# EAGLE design dimmerPower2 (EAGLE 9.2.0)
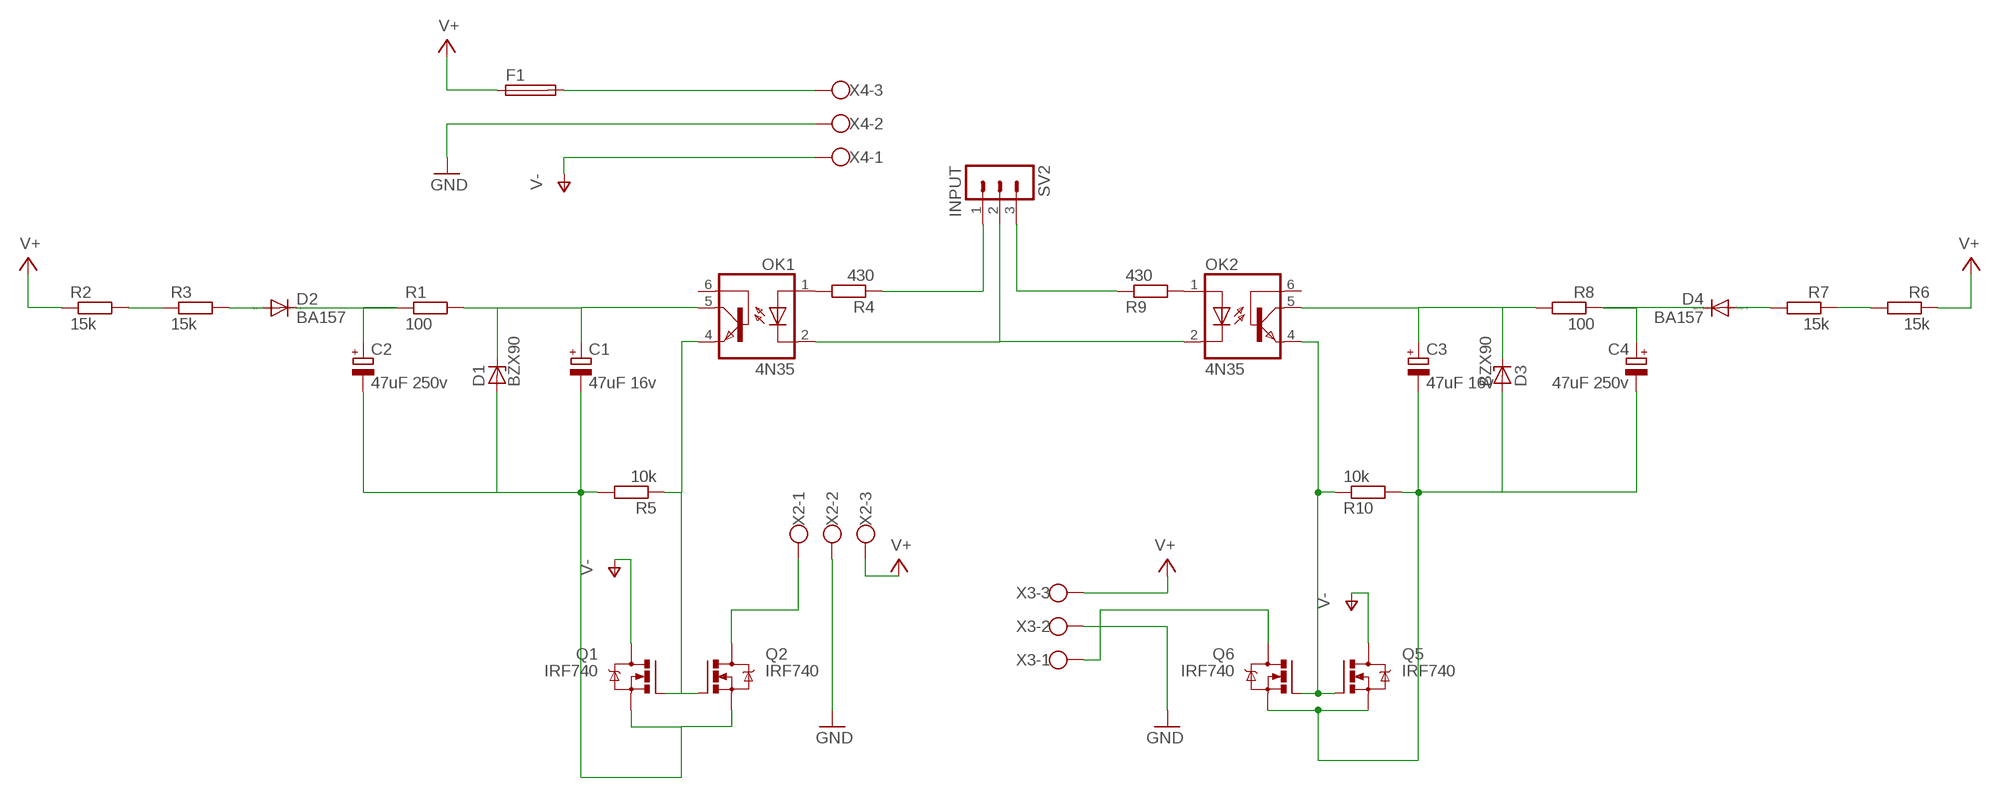
[diagram p0: schematic, sheet 1]

## Parts
C1  47uF 16v  CPOL-EUE2.5-6  [E2,5-6]
C2  47uF 250v  CPOL-EUE5-13  [E5-13]
C3  47uF 16v  CPOL-EUE2.5-6  [E2,5-6]
C4  47uF 250v  CPOL-EUE5-13  [E5-13]
D1  BZX90  [DO34Z7]
D2  BA157  [P1-10]
D3  BZX90  [DO34Z7]
D4  BA157  [P1-10]
F1  SH22,5  [SH22,5]
OK1  4N35  [DIL06]
OK2  4N35  [DIL06]
Q1  IRF740  [TO220BV]
Q2  IRF740  [TO220BV]
Q5  IRF740  [TO220BV]
Q6  IRF740  [TO220BV]
R1  100  R-EU_0204/7  [0204/7]
R2  15k  R-EU_0613/15  [P0613/15]
R3  15k  R-EU_0613/15  [P0613/15]
R4  430  R-EU_0204/7  [0204/7]
R5  10k  R-EU_0204/7  [0204/7]
R6  15k  R-EU_0613/15  [P0613/15]
R7  15k  R-EU_0613/15  [P0613/15]
R8  100  R-EU_0204/7  [0204/7]
R9  430  R-EU_0204/7  [0204/7]
R10  10k  R-EU_0204/7  [0204/7]
SV2  INPUT  MA03-1  [MA03-1]
X2  W237-103  [W237-103]
X3  W237-103  [W237-103]
X4  W237-103  [W237-103]

## Nets
GND: X2.2 X3.2 X4.2
N$1: Q6.D X3.1
N$2: OK1.2(C) OK2.2(C) SV2.2
N$3: OK1.1(A) R4.2
N$5: C3.- C4.- D3.A Q5.S Q6.S R10.2
N$6: C1.- C2.- D1.A Q1.S Q2.S R5.2
N$7: R2.2 R3.1
N$8: D2.A R3.2
N$9: C2.+ D2.C R1.1
N$10: C1.+ D1.C OK1.5(COL) R1.2
N$11: R4.1 SV2.1
N$12: Q2.D X2.1
N$13: R6.2 R7.1
N$14: D4.A R7.2
N$15: C4.+ D4.C R8.1
N$16: C3.+ D3.C OK2.5(COL) R8.2
N$17: R9.1 SV2.3
N$19: OK2.1(A) R9.2
N$20: OK1.4(EMI) Q1.G Q2.G R5.1
N$22: OK2.4(EMI) Q5.G Q6.G R10.1
V+: F1.1 R2.1 R6.1 X2.3 X3.3
V+1: F1.2 X4.3
V-: Q1.D Q5.D X4.1
Unconnected: OK1.6(BAS) OK2.6(BAS)

## Library data of the parts
C1-C4 = rcl:CPOL-EU: POLARIZED CAPACITOR, European symbol; SPICEPREFIX: C
D1 D3 = diode:BZX90: Z DIODE
D2 D4 = diode:BA157: DIODE fast soft-recovery controlled avalanche rectifier
F1 = fuse:SH22,5: FUSE HOLDER grid 22,5 mm, OGN0031 8201, Schurter (Buerklin); MF: SCHURTER; MPN: 0031.8201; OC_FARNELL: 1162740; OC_NEWARK: 96F8317
OK1 OK2 = optocoupler:4N35: MOTOROLA OPTO COUPLER; MF: FAIRCHILD SEMICONDUCTOR; MPN: 4N35; OC_FARNELL: 1328375; OC_NEWARK: 72K9946
Q1 Q2 Q5 Q6 = transistor-power:IRF740: N-CHANNEL MOS FET
R1-R10 = rcl:R-EU_: RESISTOR, European symbol; SPICEPREFIX: R
SV2 = con-lstb:MA03-1: PIN HEADER; OC_FARNELL: unknown; OC_NEWARK: unknown
X2-X4 = con-wago-500:W237-103: WAGO SCREW CLAMP; MPN: 237-103; OC_FARNELL: unknown; OC_NEWARK: 18M7116

## Board
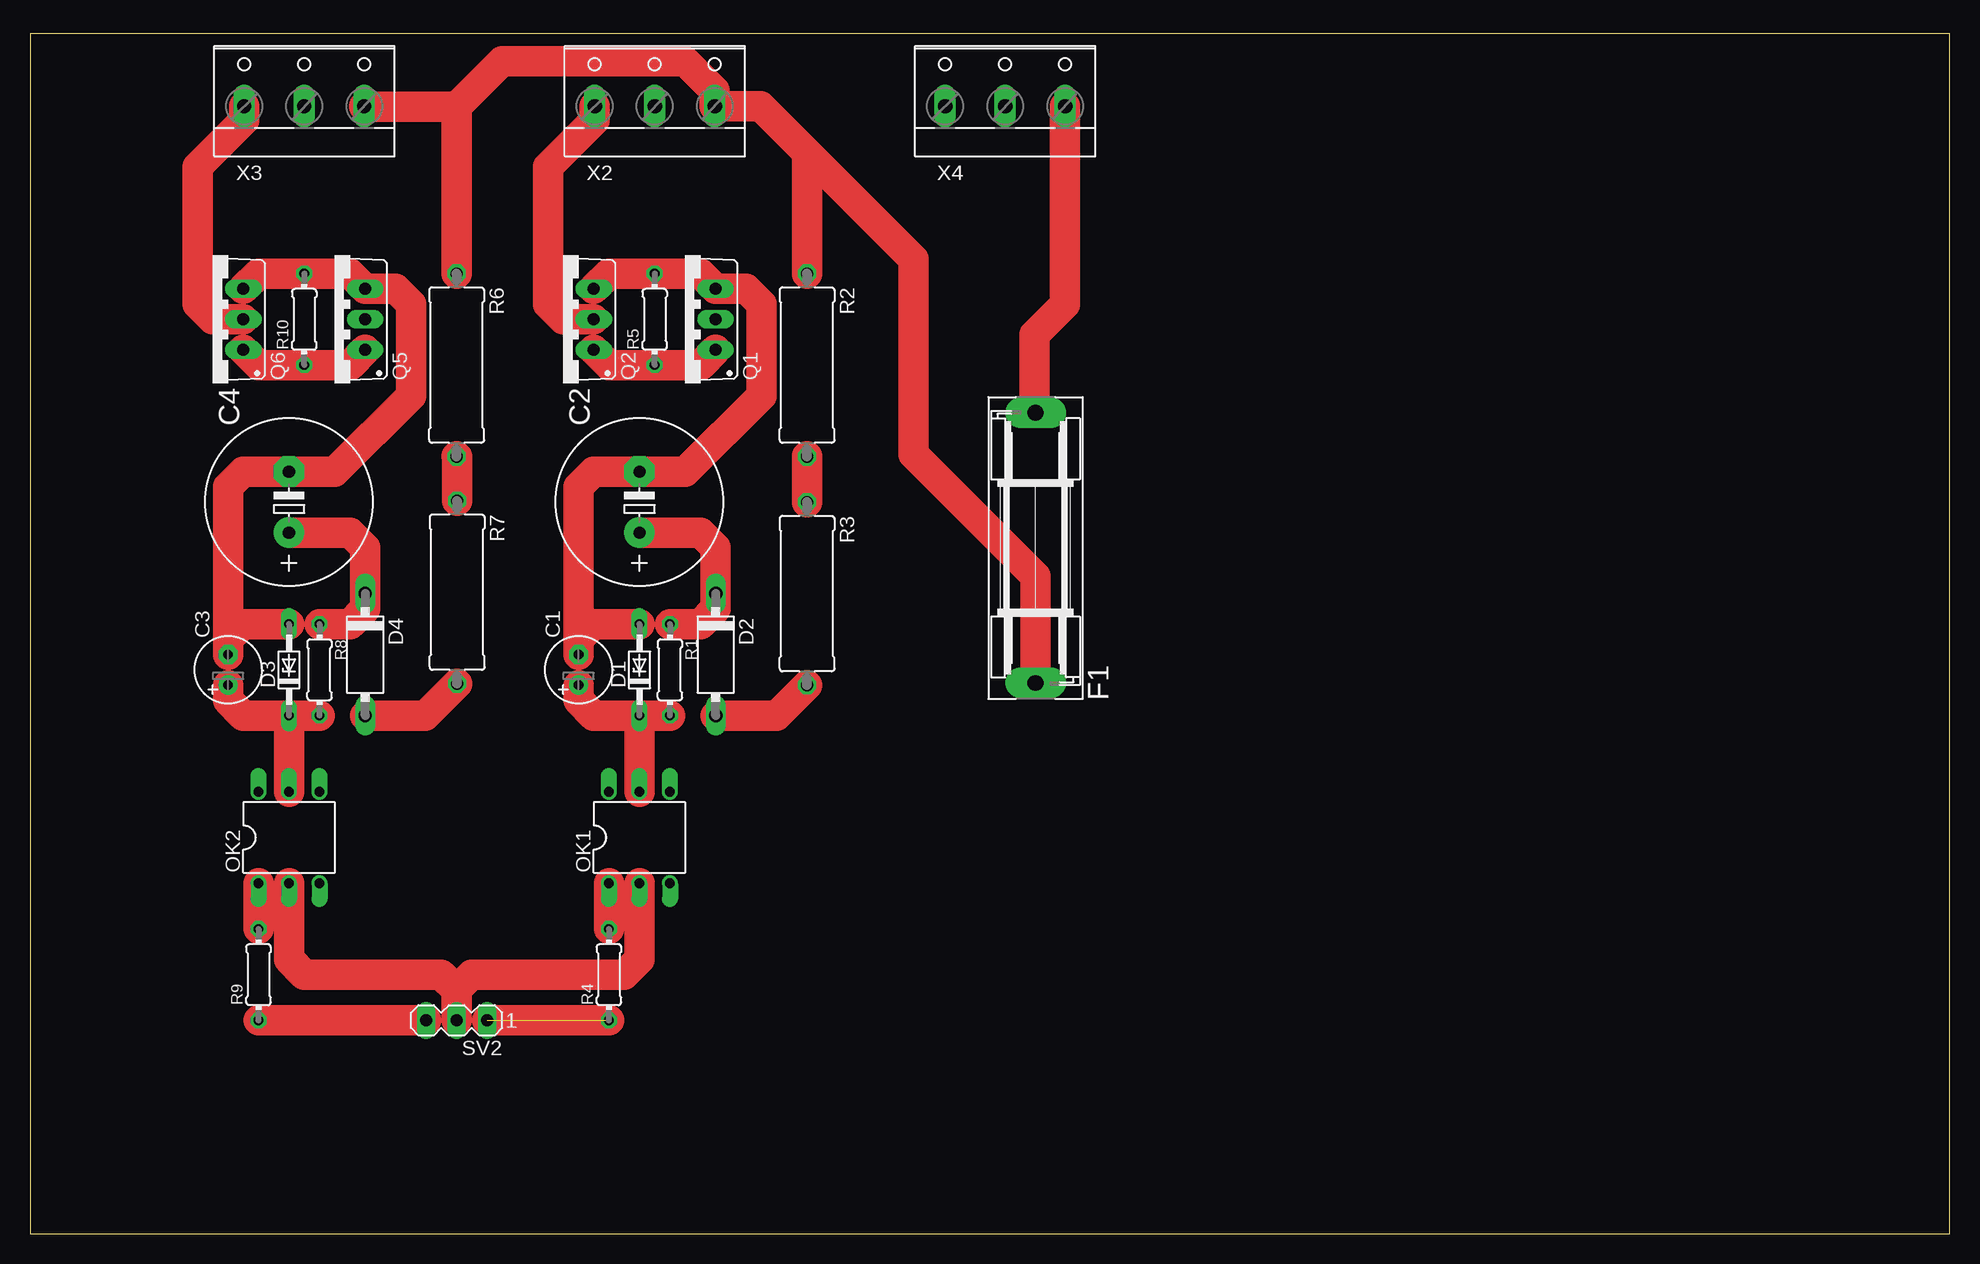
[diagram p1: board, top side]
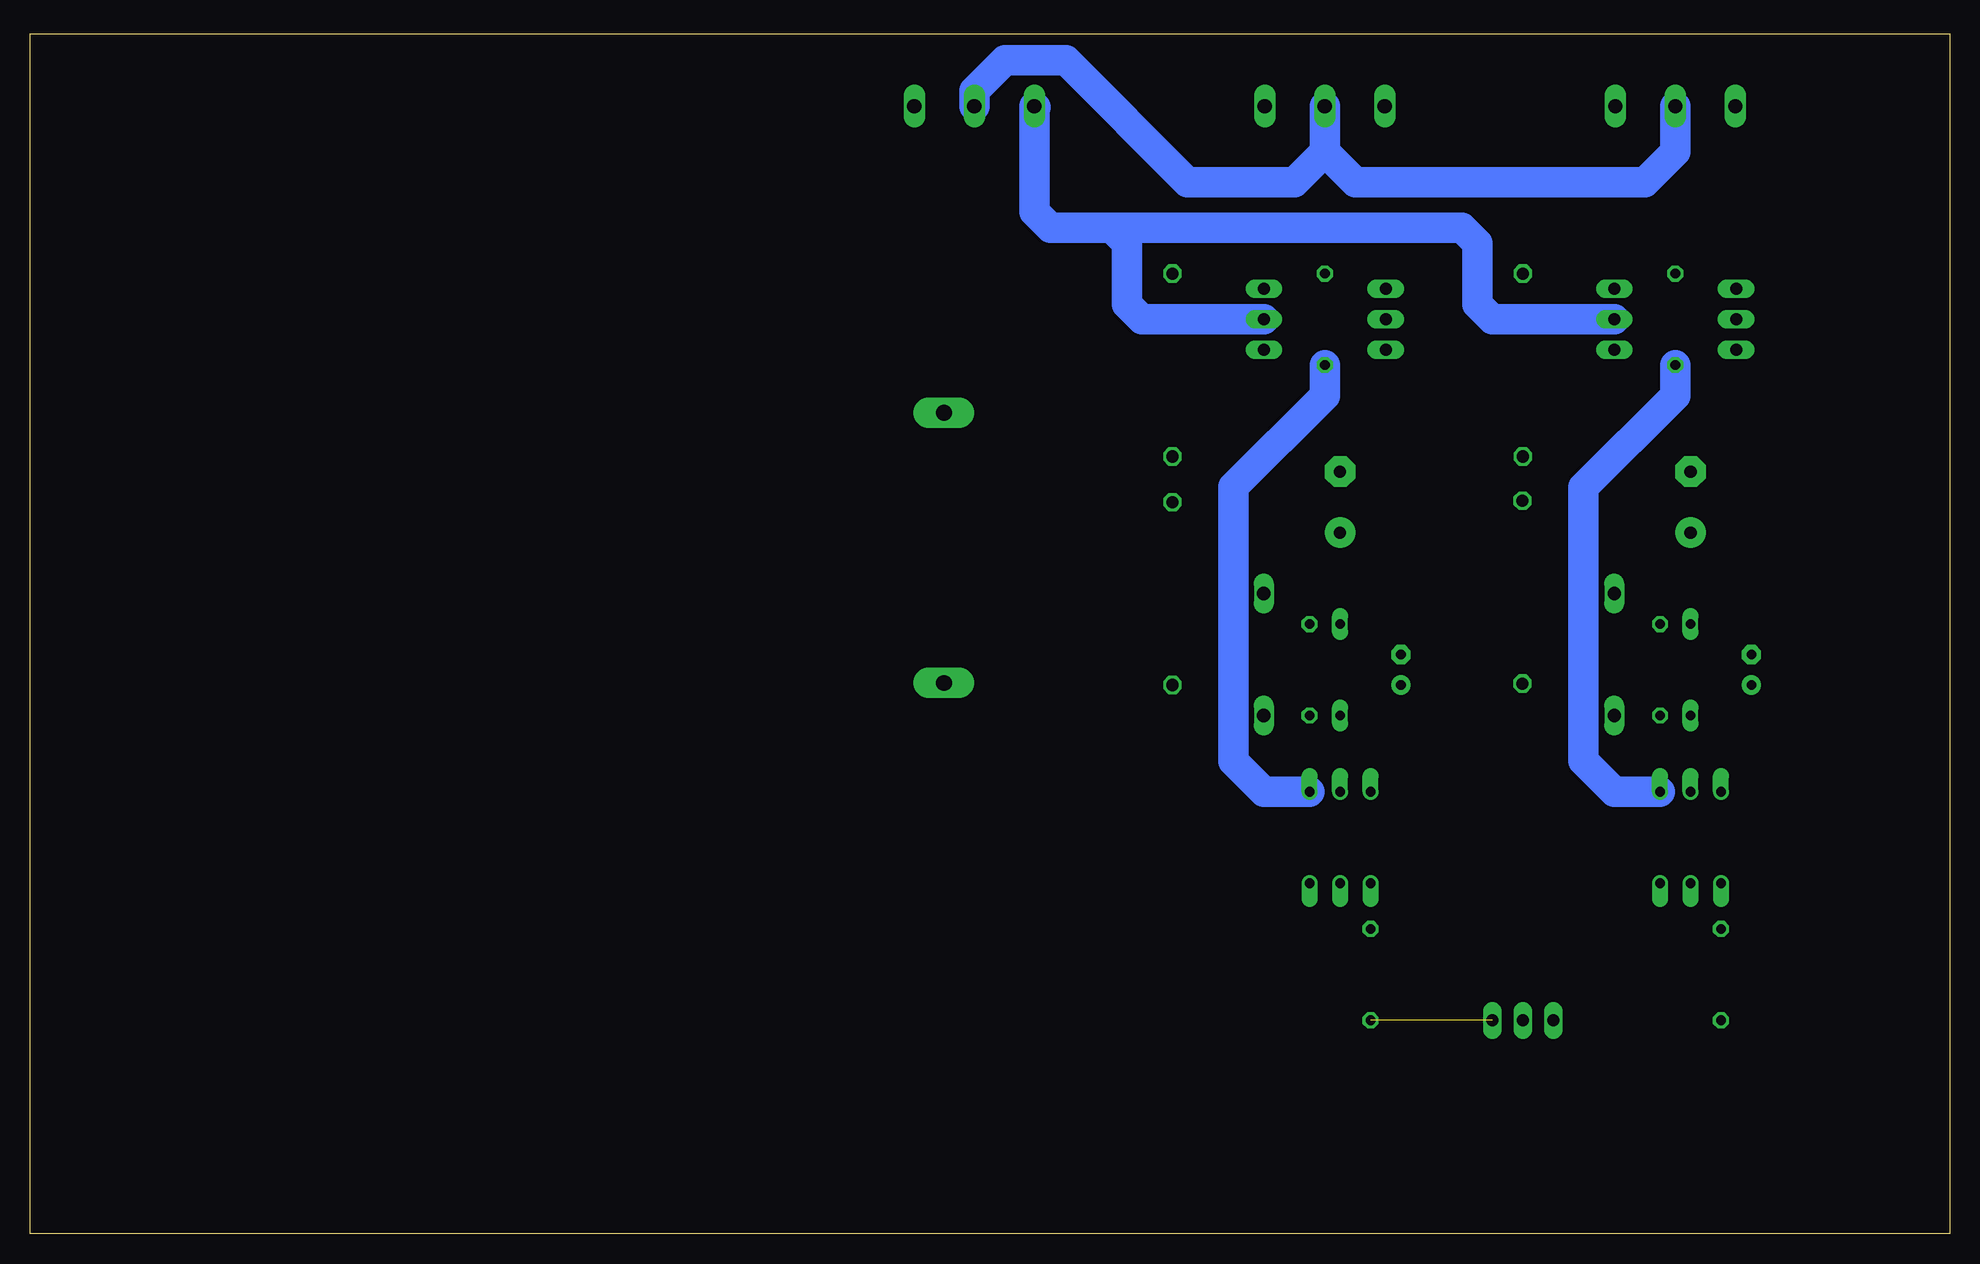
[diagram p2: board, bottom side, seen from below]

Size 160 x 100 mm. Coordinates in mm from the lower left corner, seen from the top.
Outline: 0,0 160,0 160,100 0,100 0,0
Copper layers (1*16): Top 0.035mm / dielectric 1.5mm / Bottom 0.035mm
Design rules "default *": minimum track width 100mil, minimum drill 0.35mm, track to track 6mil, track to pad 6mil, pad to pad 6mil, via to via 6mil, smd to smd 6mil, copper to edge 40mil, drill to drill 6mil, minimum pad ring 10mil, minimum via ring 8mil, stop-mask expansion 4mil, vias tented up to drill 0mil, thermal gap 10mil

### Footprints (pad centres in the part's own frame; a part is rotated, then mirrored left to right if it is on the bottom)
E2,5-6 = drill 0.813 pad 1.6: + -1.27,0 | drill 0.813 pad 1.6 octagon: - 1.27,0
E5-13 = drill 1.016 pad 2.54: + -2.54,0 | drill 1.016 pad 2.54 octagon: - 2.54,0
DO34Z7 = drill 0.813 long: A 3.81,0; C -3.81,0
P1-10 = drill 1.118 long: A 5.08,0; C -5.08,0
SH22,5 = drill 1.321 pad 2.54 long: 1 -11.252,0; 2 11.252,0
DIL06 = drill 0.813 offset: 1 -2.54,-3.81; 2 0,-3.81; 3 2.54,-3.81; 4 2.54,3.81; 5 0,3.81; 6 -2.54,3.81
TO220BV = drill 1.016 long: D 0,-2.54; G -2.54,-2.54; S 2.54,-2.54
0204/7 = drill 0.813 octagon: 1 -3.81,0; 2 3.81,0
P0613/15 = drill 1.016 octagon: 1 -7.62,0; 2 7.62,0
MA03-1 = drill 1.016 long: 1 -2.54,0; 2 0,0; 3 2.54,0
W237-103 = drill 1.194 long: 1 -5,-1.29; 2 0,-1.29; 3 5,-1.29

### Placement (x,y rotation side)
C1  45.72,46.99 90 top
C2  50.8,60.96 90 top
C3  16.51,46.99 90 top
C4  21.59,60.96 90 top
D1  50.8,46.99 90 top
D2  57.15,48.26 270 top
D3  21.59,46.99 90 top
D4  27.94,48.26 270 top
F1  83.82,57.15 90 top
OK1  50.8,33.02 0 top
OK2  21.59,33.02 0 top
Q1  54.61,76.2 90 top
Q2  44.45,76.2 90 top
Q5  25.4,76.2 90 top
Q6  15.24,76.2 90 top
R1  53.34,46.99 270 top
R2  64.77,72.39 270 top
R3  64.77,53.34 270 top
R4  48.26,21.59 90 top
R5  52.07,76.2 90 top
R6  35.56,72.39 270 top
R7  35.6,53.46 270 top
R8  24.13,46.99 270 top
R9  19.05,21.59 90 top
R10  22.86,76.2 90 top
SV2  35.56,17.78 180 top
X2  52.07,95.25 0 top
X3  22.86,95.25 0 top
X4  81.28,95.25 0 top

### Tracks (layer width: path | path; a pad name or v marks a point on that pad's centre or on a via)
GND
  Bottom 2.54: X3.2 22.86,90.15 25.4,87.61 49.53,87.61 52.07,90.15 | X4.2 81.28,95.23 78.74,97.77 73.66,97.77 63.52,87.63 54.59,87.63 52.07,90.15 | X2.2 52.07,90.15
N$1
  Top 2.54: Q6.D 15.24,76.2 13.97,77.47 13.97,88.9 17.86,92.79 X3.1
N$2
  Top 2.54: 35.56,20.32 34.29,21.59 22.86,21.59 21.59,22.86 OK2.2 | 35.56,20.32 SV2.2 | 35.56,20.32 36.83,21.59 49.53,21.59 50.8,22.86 OK1.2
N$3
  Top 2.54: OK1.1 R4.2
N$5
  Top 2.54: Q6.S 19.05,80.01 R10.2 26.67,80.01 Q5.S 30.48,78.74 31.75,77.47 31.75,69.85 25.4,63.5 C4.- 17.78,63.5 16.51,62.23 C3.- 16.51,49.53 17.78,50.8 D3.A
N$6
  Top 2.54: 45.72,49.53 46.99,50.8 D1.A 45.72,50.8 | 45.72,49.53 C1.- | Q2.S 48.26,80.01 R5.2 55.88,80.01 Q1.S 59.69,78.74 60.96,77.47 60.96,69.85 54.61,63.5 C2.- 46.99,63.5 45.72,62.23 45.72,49.53
N$7
  Top 2.54: R2.2 R3.1
N$8
  Top 2.54: D2.A 62.23,43.18 R3.2
N$9
  Top 2.54: R1.1 55.88,50.8 57.15,52.07 D2.C 57.15,57.15 55.88,58.42 C2.+
N$10
  Top 2.54: R1.2 D1.C | C1.+ 45.72,44.45 46.99,43.18 D1.C | D1.C OK1.5
N$11  (1 unrouted)
  Top 2.54: R4.1 SV2.1
N$12
  Top 2.54: Q2.D 44.45,76.2 43.18,77.47 43.18,88.9 47.07,92.79 X2.1
N$13
  Top 2.54: R6.2 35.6,64.73 R7.1
N$14
  Top 2.54: R7.2 32.94,43.18 D4.A
N$15
  Top 2.54: C4.+ 26.67,58.42 27.94,57.15 D4.C 27.94,52.07 26.67,50.8 R8.1
N$16
  Top 2.54: R8.2 D3.C | C3.+ 16.51,44.45 17.78,43.18 D3.C | D3.C OK2.5
N$17
  Top 0.152: 33.02,17.99 SV2.3
  Top 2.54: SV2.3 R9.1
N$19
  Top 2.54: OK2.1 R9.2
N$20
  Top 2.54: Q2.G 48.26,72.39 R5.1 55.88,72.39 Q1.G
  Bottom 2.54: OK1.4 57.15,36.83 59.69,39.37 59.69,62.23 52.07,69.85 R5.1
N$22
  Top 2.54: Q5.G 26.67,72.39 R10.1 19.05,72.39 Q6.G
  Bottom 2.54: R10.1 22.86,69.85 30.52,62.19 30.52,39.41 27.94,36.83 OK2.4
V+
  Top 0.152: 64.82,80.06 R2.1 | 27.99,93.88 X3.3
  Top 2.54: 27.88,93.98 X3.3 27.92,93.9 35.56,93.9 | 64.77,90.07 60.88,93.96 X2.3 57.07,95.25 54.61,97.71 39.37,97.71 35.56,93.9 | F1.1 83.82,54.79 73.66,64.95 73.66,81.2 64.77,90.09 64.77,90.07 | R6.1 35.56,93.9 | 64.77,90.07 R2.1
V+1
  Top 2.54: F1.2 83.74,68.48 83.74,74.91 86.28,77.45 X4.3
V-
  Bottom 2.54: 76.2,93.88 X4.1 76.28,85.17 74.93,83.82 69.85,83.82 | 69.85,83.82 40.64,83.82 39.37,82.55 39.37,77.47 38.1,76.2 Q5.D | Q1.D 67.31,76.2 68.58,77.47 68.58,82.55 69.85,83.82